# EAGLE board M.2 SoM breakout board v0.1 (EAGLE 9.6.2), part 1 of 2
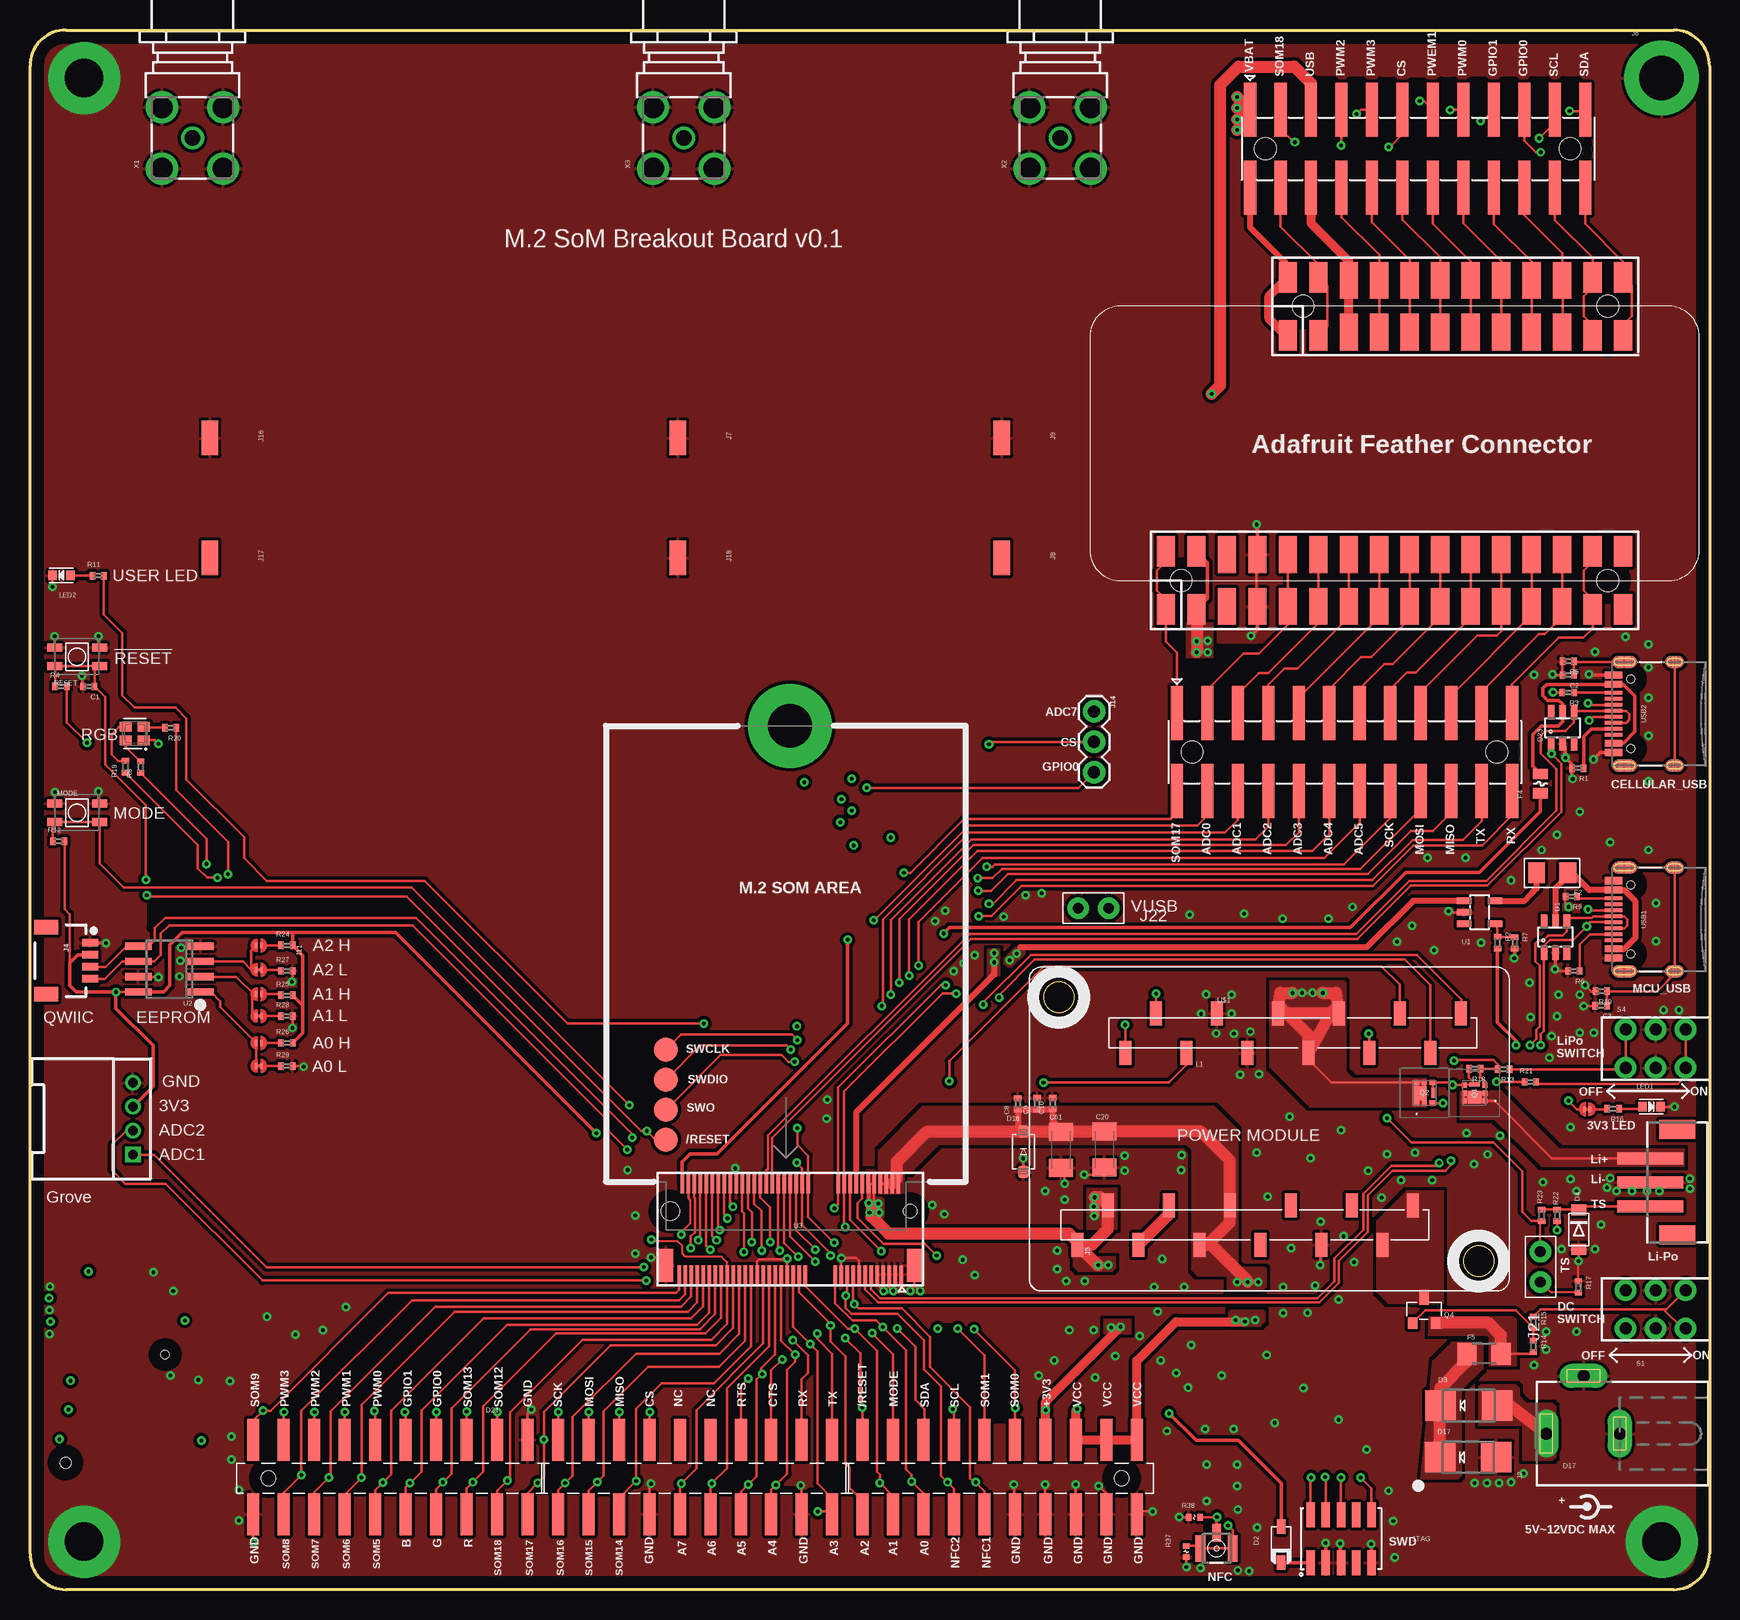
[diagram p3: board, top side]
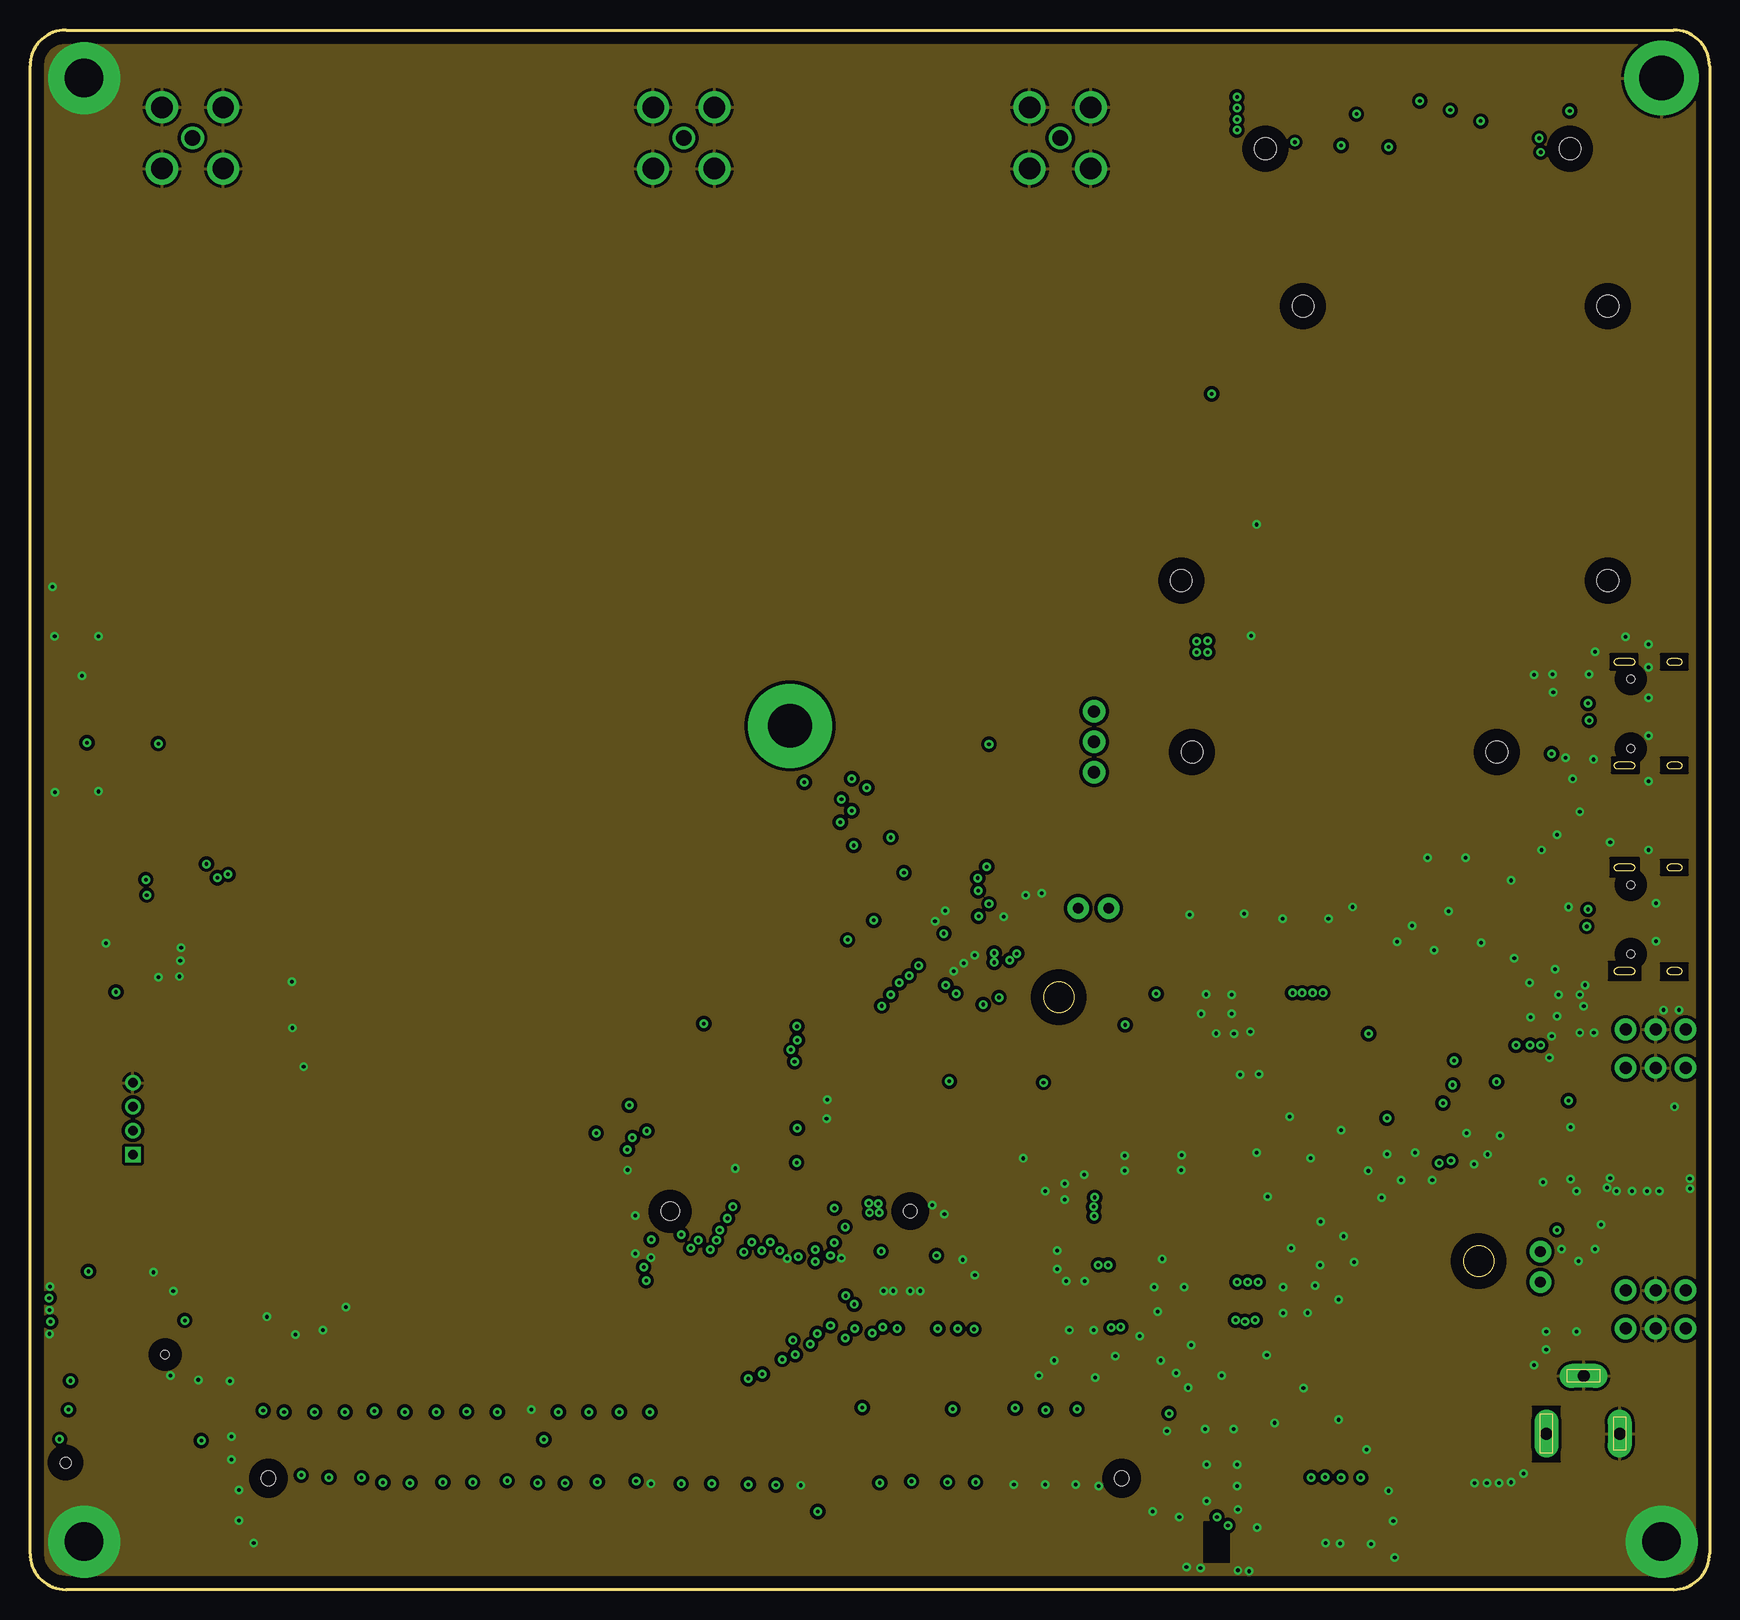
[diagram p4: board, inner layer GND]
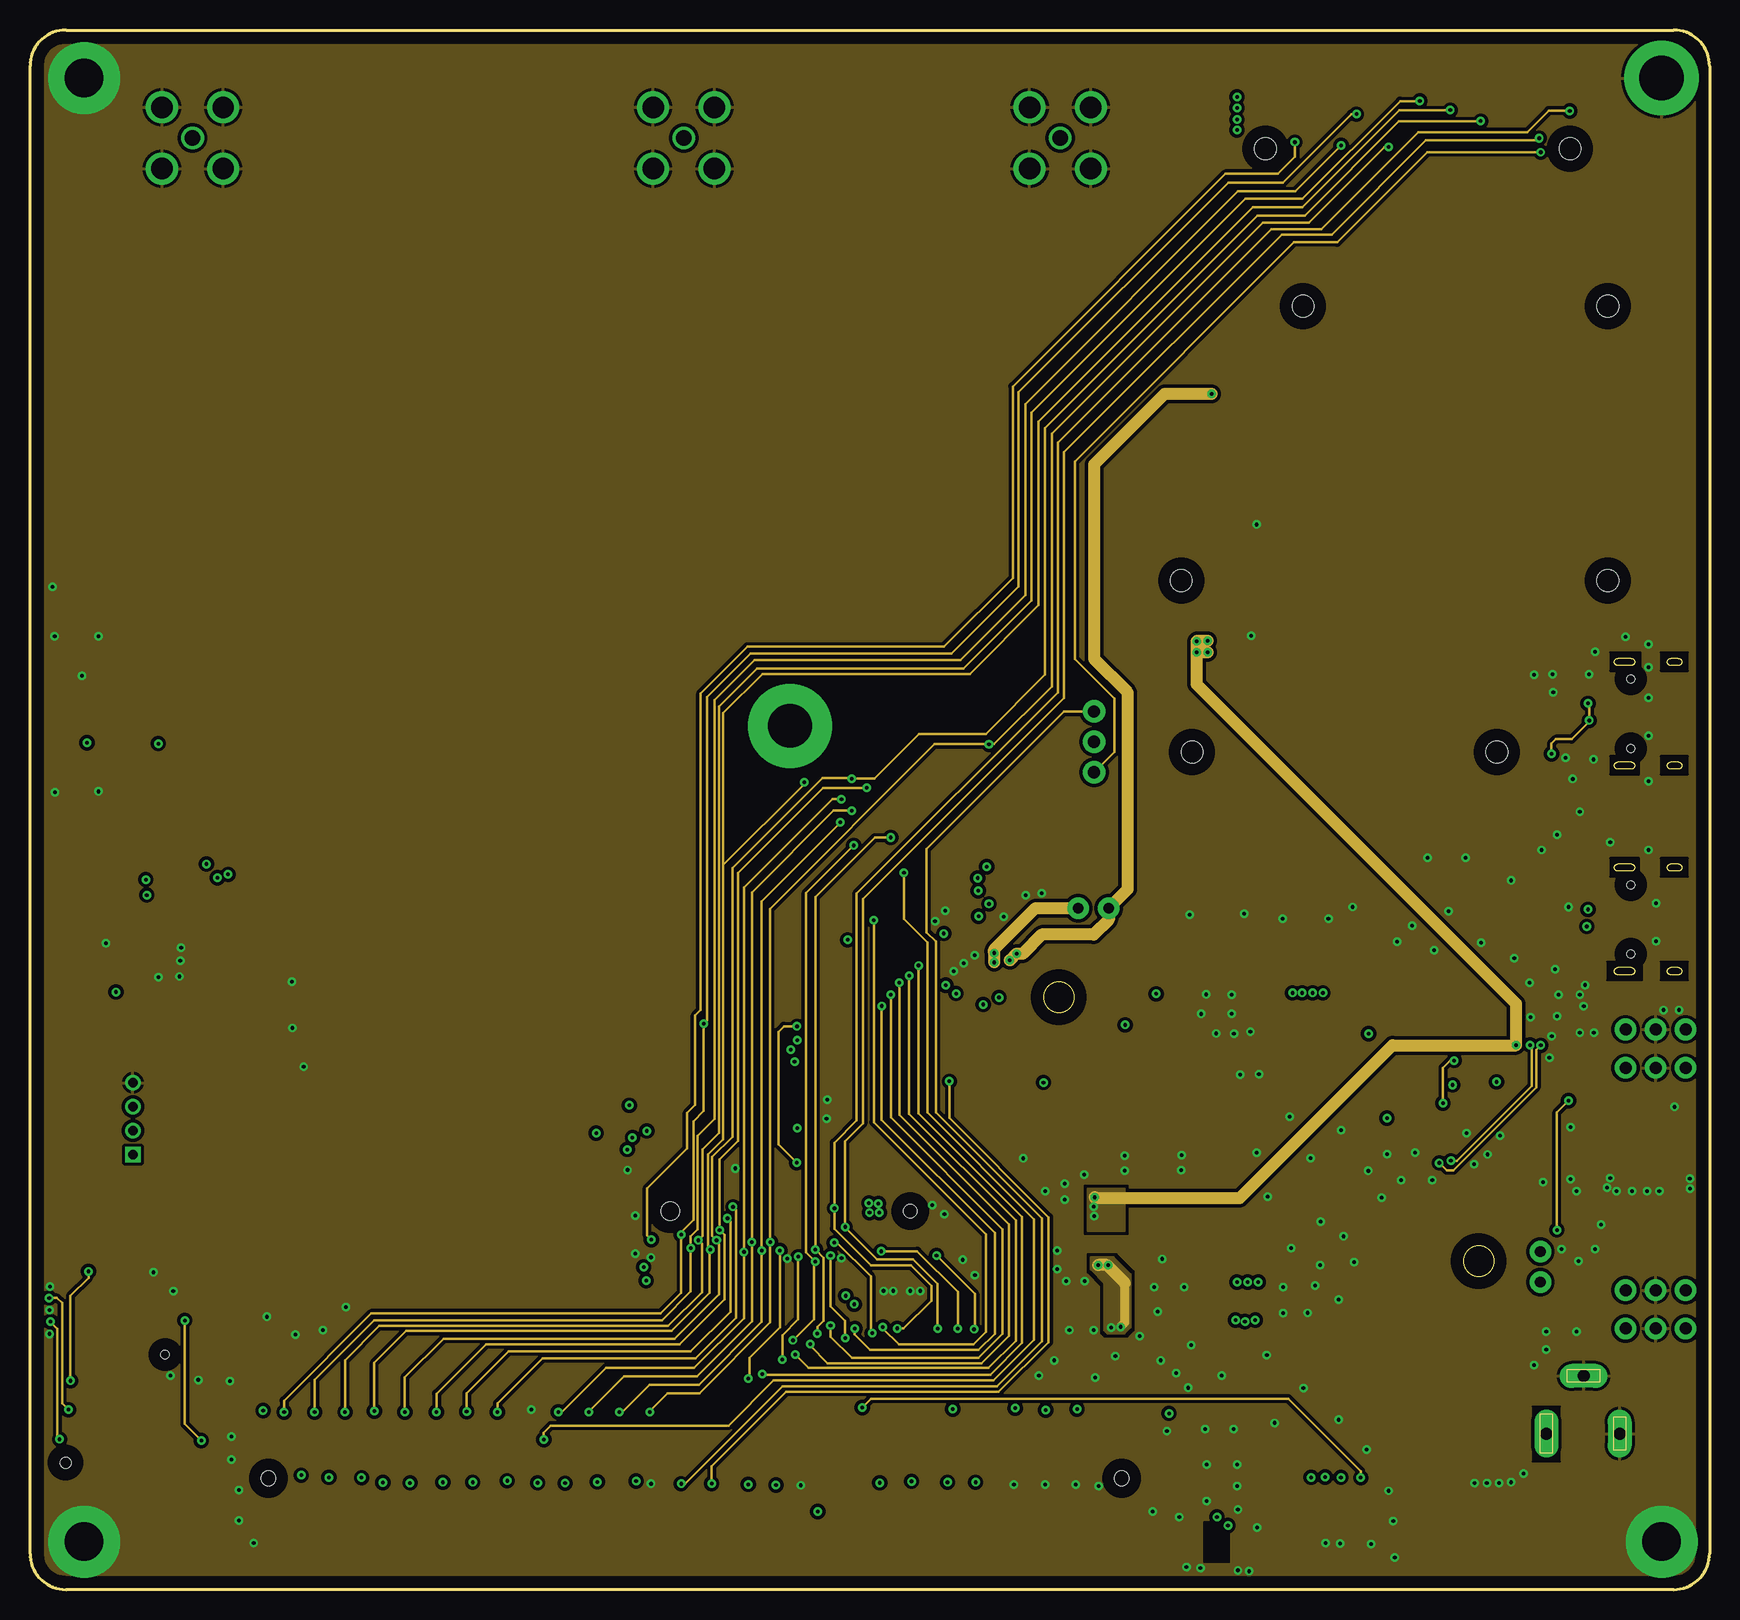
[diagram p5: board, inner layer POWER]
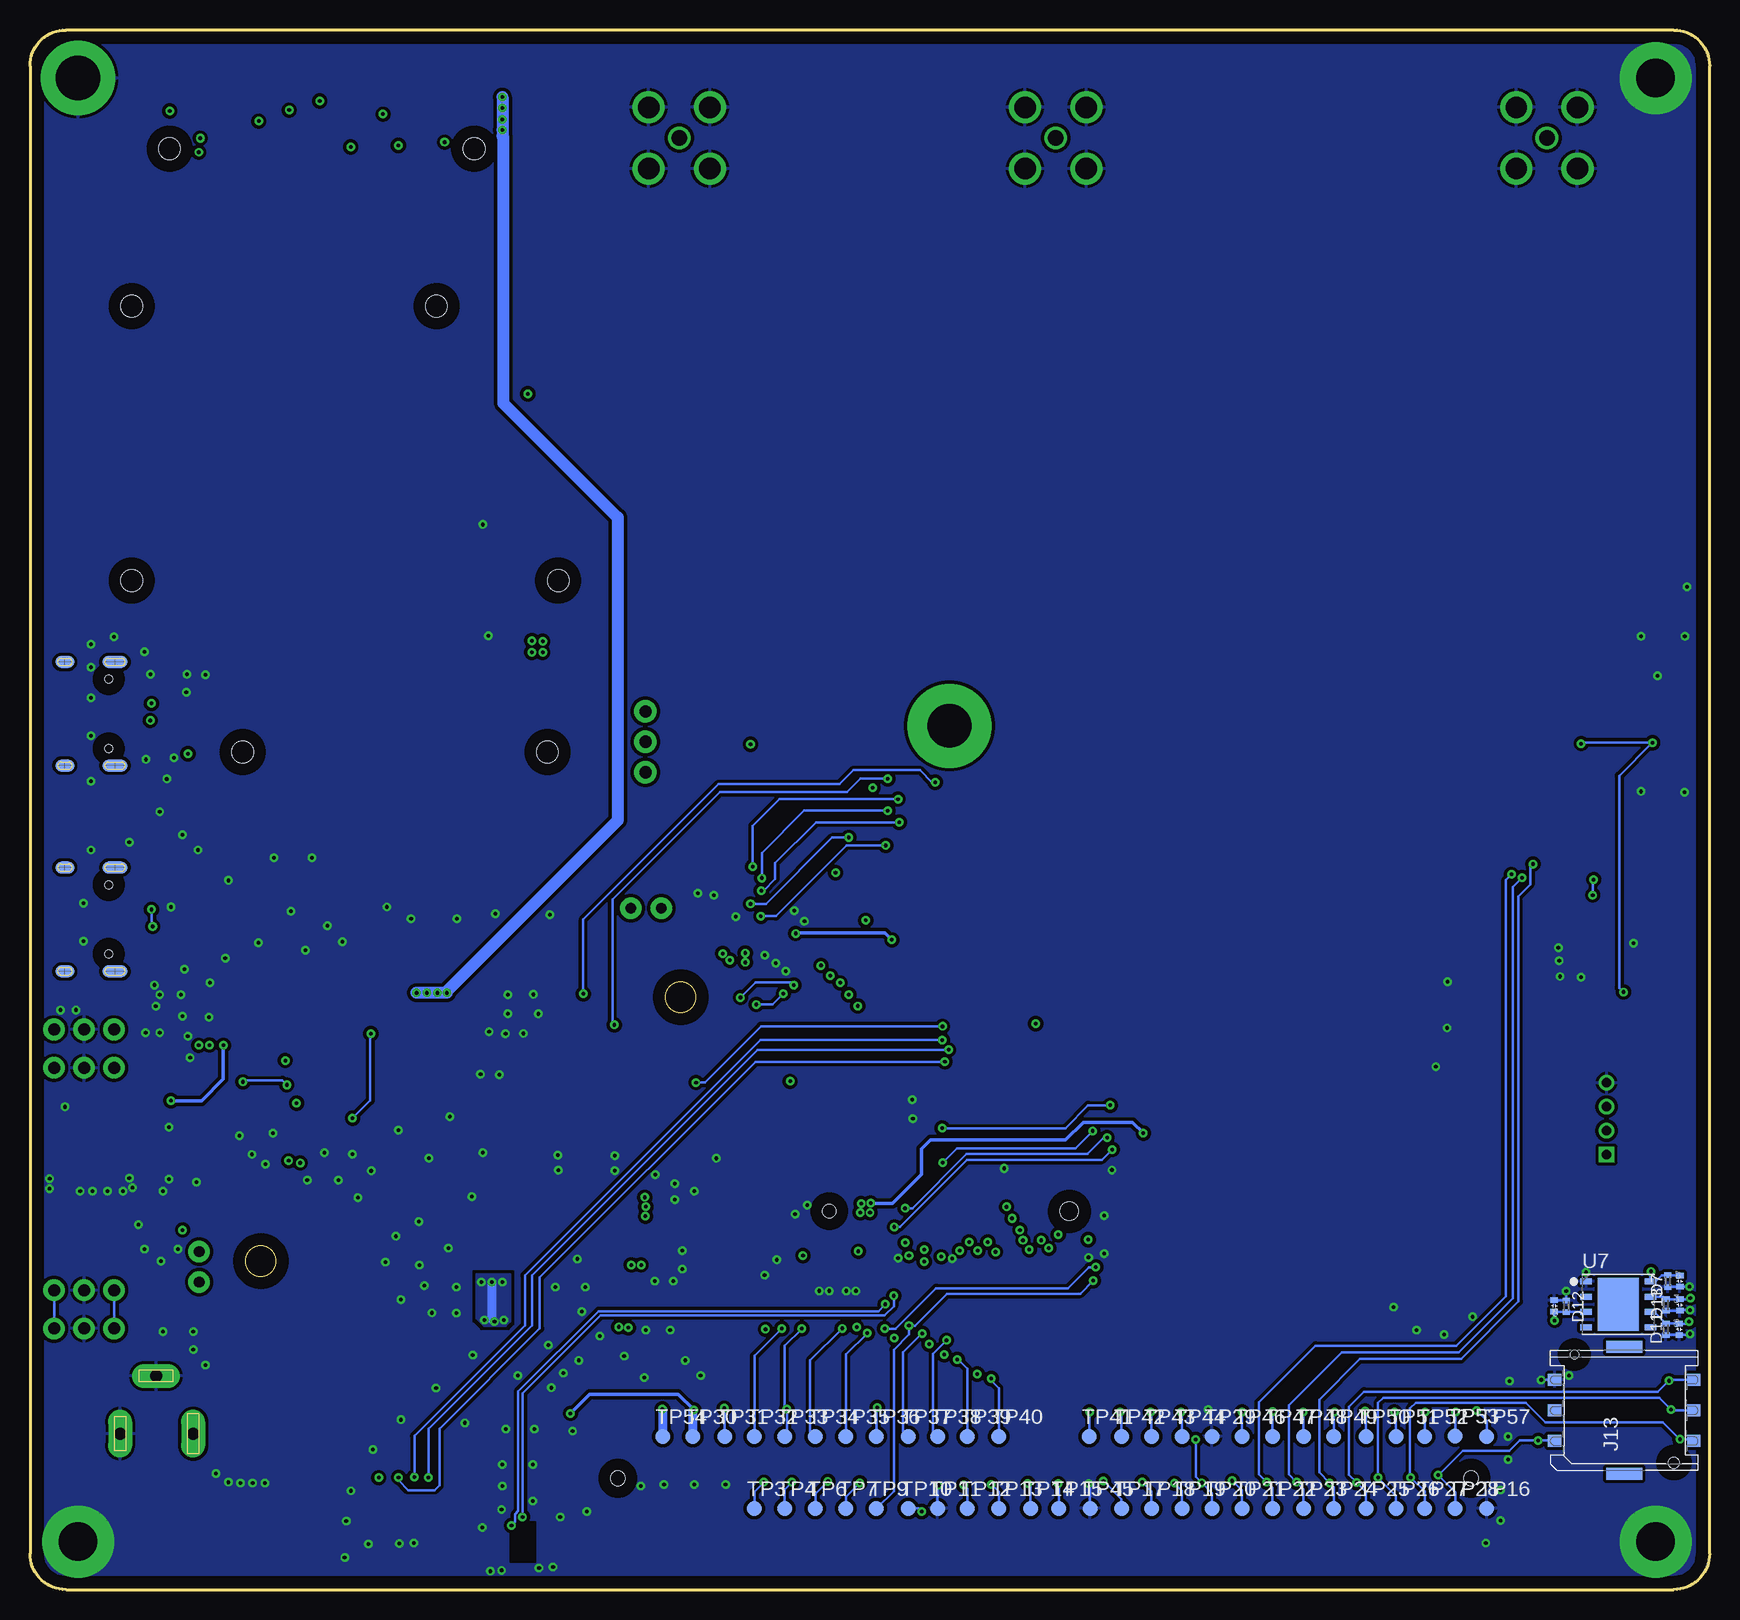
[diagram p6: board, bottom side, seen from below]

Size 140 x 130 mm. Coordinates in mm from the lower left corner, seen from the top.
Outline: 3,130 137,130 arc-90 140,127 140,3 arc-90 137,0 3,0 arc-90 0,3 0,127 arc-90 3,130
Copper layers (1+2*3+16): Top 0.035mm / dielectric 1.5mm / GND 0.035mm / dielectric 0.15mm / POWER 0.035mm / dielectric 0.2mm / Bottom 0.035mm
Design rules "default *": minimum track width 6mil, minimum drill 0.3mm, track to track 6mil, track to pad 6mil, pad to pad 6mil, via to via 6mil, smd to smd 6mil, copper to edge 40mil, drill to drill 6mil, minimum pad ring 10mil, minimum via ring 8mil, stop-mask expansion 4mil, vias tented up to drill 0.35mm, thermal gap 10mil
Net classes: 0 default: width 0.152 mm, clearance 0.152 mm; 1 power: width 0.254 mm, drill 0.61 mm, clearance 0.203 mm; 2 120R_Impedance: width 0.152 mm; 3 BAT: clearance 0.203 mm
tKeepout: 1 lines
tRestrict: 57 lines

## Footprints (pad centres in the part's own frame; a part is rotated, then mirrored left to right if it is on the bottom)
C0402_B = smd 0.457 x 0.61: 1 -0.483,0; 2 0.483,0
C1206K = smd 1.5 x 2: 1 -1.5,0; 2 1.5,0
SOT23-6 = smd 0.55 x 1.2: 1 -0.95,-1.3; 2 0,-1.3; 3 0.95,-1.3; 4 0.95,1.3; 5 0,1.3; 6 -0.95,1.3
SOD-123 = smd 1.2 x 0.7: 1 -1.5,0; 2 1.5,0
SMADIODE = smd 2.54 x 2.54: A 2.349,0; C -2.349,0
SOD-123FL = smd 0.91 x 1.22: A 1.637,0; C -1.637,0
C0402 = smd 0.45 x 0.6: 1 -0.47,0; 2 0.47,0
SOD-123' = smd 1.02 x 0.86: A 1.68,0; C -1.68,0
R1206 = smd 1.4 x 1.7: 1 -1.3,0; 2 1.3,0
F0805 = smd 0.85 x 1.25: P$1 -0.8,0; P$2 0.8,0
R1206' = smd 1.6 x 1.803: 1 -1.422,0; 2 1.422,0
JST-3-SMD-VERT = smd 1 x 5.5: 1 -2,0; 2 0,0; 3 2,0 | smd 1.6 x 3: PAD1 -4.4,-2.25; PAD2 4.4,-2.25
DCJ0202 = drill 1 pad 2 long: 1 0,3.1; 2 4.8,0; 3 0,-3
SPARK_CON_30X2_SMD = smd 1 x 3.5: 1 0,3.013; 2 0,-3.213; 3 2.54,3.013; 4 2.54,-3.213; 5 5.08,3.013; 6 5.08,-3.213; 7 7.62,3.013; 8 7.62,-3.213; 9 10.16,3.013; 10 10.16,-3.213; 11 12.7,3.013; 12 12.7,-3.213; 13 15.24,3.013; 14 15.24,-3.213; 15 17.78,3.013; 16 17.78,-3.213; 17 20.32,3.013; 18 20.32,-3.213; 19 22.86,3.013; 20 22.86,-3.213; 21 25.4,3.013; 22 25.4,-3.213; 23 27.94,3.013; 24 27.94,-3.213; 25 30.48,3.013; 26 30.48,-3.213; 27 33.02,3.013; 28 33.02,-3.213; 29 35.56,3.013; 30 35.56,-3.213; 31 38.1,3.013; 32 38.1,-3.213; 33 40.64,3.013; 34 40.64,-3.213; 35 43.18,3.013; 36 43.18,-3.213; 37 45.72,3.013; 38 45.72,-3.213; 39 48.26,3.013; 40 48.26,-3.213; 41 50.8,3.013; 42 50.8,-3.213; 43 53.34,3.013; 44 53.34,-3.213; 45 55.88,3.013; 46 55.88,-3.213; 47 58.42,3.013; 48 58.42,-3.213; 49 60.96,3.013; 50 60.96,-3.213; 51 63.5,3.013; 52 63.5,-3.213; 53 66.04,3.013; 54 66.04,-3.213; 55 68.58,3.013; 56 68.58,-3.213; 57 71.12,3.013; 58 71.12,-3.213; 59 73.66,3.013; 60 73.66,-3.213 | hole 1.2: 1.27,0; 72.39,0
1X04_1MM_RA = smd 0.6 x 1.35: 1 -1.5,0; 2 -0.5,0; 3 0.5,0; 4 1.5,0 | smd 1.2 x 2: NC1 2.8,-3.675; NC2 -2.8,-3.675
PARTICLE-POWER-MODULE = smd 1 x 2: 1 31.99,7.15; 2 29.45,3.85; 3 26.91,7.15; 4 24.37,3.85; 5 21.83,7.15; 6 19.29,3.85; 7 16.75,7.15; 8 14.21,3.85; 9 11.67,7.15; 10 9.13,3.85; 11 6.59,7.15; 12 4.05,3.85; 13 35.99,23.15; 14 33.45,19.85; 15 30.91,23.15; 16 28.37,19.85; 17 25.83,23.15; 18 23.29,19.85; 19 20.75,23.15; 20 18.21,19.85; 21 15.67,23.15; 22 13.13,19.85; 23 10.59,23.15; 24 8.05,19.85
SCREW-HOLE-3.7 = drill 3.7 pad 6.2: P$1 0,0
ANTENNA-CLAMP1.13 = smd 2.9 x 1.4: 1 0,0
CON_12*2_SMD_HEADER = smd 1.02 x 4.5: 1 0,0.65; 2 0,-5.85; 3 2.54,0.65; 4 2.54,-5.85; 5 5.08,0.65; 6 5.08,-5.85; 7 7.62,0.65; 8 7.62,-5.85; 9 10.16,0.65; 10 10.16,-5.85; 11 12.7,0.65; 12 12.7,-5.85; 13 15.24,0.65; 14 15.24,-5.85; 15 17.78,0.65; 16 17.78,-5.85; 17 20.32,0.65; 18 20.32,-5.85; 19 22.86,0.65; 20 22.86,-5.85; 21 25.4,0.65; 22 25.4,-5.85; 23 27.94,0.65; 24 27.94,-5.85 | hole 1.8: 1.27,-2.6; 26.67,-2.6
HW4-2.0-90D = drill 0.8 pad 1.27 square: 1 -3,0 | drill 0.8 pad 1.27: 2 -1,0; 3 1,0; 4 3,0
TP_OPEN = smd 0.2 x 0.5: 1 -0.21,0; 2 0.21,0
GCT-SIM8100 = smd 1 x 1.1: C1 2.54,-5.8; C2 0,-5.8; C3 -2.54,-5.8; C5 2.54,5.8; C6 0,5.8; C7 -2.54,5.8 | smd 1 x 3: NC@1 -5.3,0; NC@2 5.3,0 | hole 0.7: 4.65,4.15 | hole 0.9: -4.35,-4.15
1X03 = drill 1.016 pad 1.88: 1 0,0; 2 2.54,0; 3 5.08,0
SIP-2 = drill 0.9 pad 1.8: 1 -1.27,0; 2 1.27,0
CONN5X2_1.27 = smd 0.7 x 2.1: 1 -2.54,-2; 2 -2.54,2; 3 -1.27,-2; 4 -1.27,2; 5 0,-2; 6 0,2; 7 1.27,-2; 8 1.27,2; 9 2.54,-2; 10 2.54,2
LED0603 = smd 0.7 x 0.8: 1 -0.75,0; 2 0.75,0
TACTILE_SWITCH_SMD = smd 1.25 x 0.65: 1 -1.875,0.775; 2 1.875,0.775; 3 -1.875,-0.775; 4 1.875,-0.775
FEATHERWING_SMT2 = smd 1.524 x 2.54: 1 6.35,2.413; 1' 6.35,-2.413; 2 8.89,2.413; 2' 8.89,-2.413; 15 41.91,2.413; 15' 41.91,-2.413; 16 44.45,2.413; 16' 44.45,-2.413; 17 44.45,20.447; 17' 44.45,25.273; 18 41.91,20.447; 18' 41.91,25.273; 27 19.05,20.447; 27' 19.05,25.273; 28 16.51,20.447; 28' 16.51,25.273 | smd 1.524 x 3.048: 3 11.43,2.159; 3' 11.43,-2.159; 4 13.97,2.159; 4' 13.97,-2.159; 5 16.51,2.159; 5' 16.51,-2.159; 6 19.05,2.159; 6' 19.05,-2.159; 7 21.59,2.159; 7' 21.59,-2.159; 8 24.13,2.159; 8' 24.13,-2.159; 9 26.67,2.159; 9' 26.67,-2.159; 10 29.21,2.159; 10' 29.21,-2.159; 11 31.75,2.159; 11' 31.75,-2.159; 12 34.29,2.159; 12' 34.29,-2.159; 13 36.83,2.159; 13' 36.83,-2.159; 14 39.37,2.159; 14' 39.37,-2.159; 19 39.37,20.701; 19' 39.37,25.019; 20 36.83,20.701; 20' 36.83,25.019; 21 34.29,20.701; 21' 34.29,25.019; 22 31.75,20.701; 22' 31.75,25.019; 23 29.21,20.701; 23' 29.21,25.019; 24 26.67,20.701; 24' 26.67,25.019; 25 24.13,20.701; 25' 24.13,25.019; 26 21.59,20.701; 26' 21.59,25.019 | hole 1.8: 17.78,22.86; 43.18,22.86; 7.62,0; 43.18,0
IPEX-20279-001E = smd 0.73 x 1.5: 1 0,1.28 | smd 0.8 x 2.2: 2@1 -1.35,0; 2@2 1.35,0
RF4C100BCTCR = smd 0.45 x 0.425: 1 -0.65,-0.862; 2 0,-0.862; 3 0.65,-0.862; 4 0.65,0.863; 5 0,0.863; 6 -0.65,0.863 | smd 1.05 x 1.15: 7 -0.35,0 | smd 0.3 x 0.85: 8 0.725,0
SOT-23 = smd 0.8 x 0.95: 1 -0.95,-1; 2 0.95,-1 | smd 0.8 x 1.25: 3 0,1.15
R0402_B = smd 0.457 x 0.61: 1 -0.483,0; 2 0.483,0
R-0402S = smd 0.45 x 0.55: 1 -0.47,0; 2 0.47,0
PLCC4-2MM-RGB = smd 1 x 0.8: BLUE -0.75,-0.55; CA 0.75,-0.55; GREEN -0.75,0.55; RED 0.75,0.55
SWITCH-2.5X3.2-6 = drill 1 pad 1.8: 1 0,0; 2 0,2.5; 3 0,5; 4 3.2,0; 5 3.2,2.5; 6 3.2,5
TP_SHORT = smd 0.2 x 0.5: 1 -0.21,0; 2 0.21,0
B1,27 = smd 1.27 x 1.27: TP 0,0
SOT25 = smd 0.55 x 1.2: 1 -0.95,-1.3; 2 0,-1.3; 3 0.95,-1.3; 4 0.95,1.3; 5 -0.95,1.3
SO-08 = smd 0.6 x 2.2: 1 -1.905,-2.6; 2 -0.635,-2.6; 3 0.635,-2.6; 4 1.905,-2.6; 5 1.905,2.6; 6 0.635,2.6; 7 -0.635,2.6; 8 -1.905,2.6
PARTICLE_M.2EKEY_3.65MM_DRILL = smd 0.3 x 1.55: 1 -9.62,3.735; 2 -9.37,-3.815; 3 -9.12,3.735; 4 -8.87,-3.815; 5 -8.62,3.735; 6 -8.37,-3.815; 7 -8.12,3.735; 8 -7.87,-3.815; 9 -7.62,3.735; 10 -7.37,-3.815; 11 -7.12,3.735; 12 -6.87,-3.815; 13 -6.62,3.735; 14 -6.37,-3.815; 15 -6.12,3.735; 16 -5.87,-3.815; 17 -5.62,3.735; 18 -5.37,-3.815; 19 -5.12,3.735; 20 -4.87,-3.815; 21 -4.62,3.735; 22 -4.37,-3.815; 23 -4.12,3.735; 32 -1.87,-3.815; 33 -1.62,3.735; 34 -1.37,-3.815; 35 -1.12,3.735; 36 -0.87,-3.815; 37 -0.62,3.735; 38 -0.37,-3.815; 39 -0.12,3.735; 40 0.13,-3.815; 41 0.38,3.735; 42 0.63,-3.815; 43 0.88,3.735; 44 1.13,-3.815; 45 1.38,3.735; 46 1.63,-3.815; 47 1.88,3.735; 48 2.13,-3.815; 49 2.38,3.735; 50 2.63,-3.815; 51 2.88,3.735; 52 3.13,-3.815; 53 3.38,3.735; 54 3.63,-3.815; 55 3.88,3.735; 56 4.13,-3.815; 57 4.38,3.735; 58 4.63,-3.815; 59 4.88,3.735; 60 5.13,-3.815; 61 5.38,3.735; 62 5.63,-3.815; 63 5.88,3.735; 64 6.13,-3.815; 65 6.38,3.735; 66 6.63,-3.815; 67 6.88,3.735; 68 7.13,-3.815; 69 7.38,3.735; 70 7.63,-3.815; 71 7.88,3.735; 72 8.13,-3.815; 73 8.38,3.735; 74 8.63,-3.815; 75 8.88,3.735 | smd 1.2 x 2.75: 76 9.98,2.96; 77 -10.72,2.96 | smd 2 x 2: !RESET 10,-7.5; SWCLK 10,-15; SWDIO 10,-12.5; SWO 10,-10 | drill 3.65 pad 7: GND -0.351,-42 | hole 1.1: -10.37,-1.54 | hole 1.55: 9.63,-1.54
MFF2 = smd 0.96 x 0.5: 1 -2.675,1.905; 2 -2.675,0.635; 3 -2.675,-0.635; 4 -2.675,-1.905; 5 2.675,-1.905; 6 2.675,-0.635; 7 2.675,0.635; 8 2.675,1.905 | smd 3.4 x 4.4: P$1 0,0
USB-C-16P = smd 0.3 x 1.45: A5 -1.25,0; A6 -0.25,0; A7 0.25,0; A8 1.25,0; B5 1.75,0; B6 0.75,0; B7 -0.75,0; B8 -1.75,0 | smd 0.6 x 1.45: GND -3.225,0; GND2 3.225,0 | smd 1 x 2.1: SHLD1 -4.32,-0.915; SHLD2 4.32,-0.915 | smd 1 x 2.1 bottom: SHLD3 -4.32,-0.915; SHLD4 4.32,-0.915 | smd 1 x 1.6: SHLD5 -4.32,-5.095; SHLD8 4.32,-5.095 | smd 1 x 1.6 bottom: SHLD6 -4.32,-5.095; SHLD7 4.32,-5.095 | smd 0.55 x 1.45: VBUS1 -2.45,0; VBUS2 2.45,0 | hole 0.65: -2.89,-1.445; 2.89,-1.445
BU-SMA-G = drill 1.27: 1 0,0 | drill 1.778: 2 -2.55,2.55; 3 2.55,2.55; 4 2.55,-2.55; 5 -2.55,-2.55

## Placement (x,y rotation side)
C1  0.1uF  [C0402_B]  4.9,75.27 180 top
C2  0.1uF  [C0402_B]  128.22,76.22 180 top
C3  0.1uF  [C0402_B]  130.96,48.67 180 top
C4  33pF  [C0402_B]  3.63,23.72 270 bottom
C5  33pF  [C0402_B]  11.94,23.62 90 bottom
C6  33pF  [C0402_B]  3.63,21.7 270 bottom
C7  0.1uF  [C0402_B]  3.48,25.71 270 bottom
C8  1nF  [C0402_B]  82.34,40.49 90 top
C9  100pF  [C0402_B]  83.95,40.5 90 top
C10  33pF  [C0402_B]  85.25,40.51 90 top
C20  100uF  [C1206K]  89.56,36.67 270 top
C61  100uF  [C1206K]  85.93,36.64 270 top
D1  TPESD0504S6  [SOT23-6]  127.16,54.39 0 top
D2  B5819w  [SOD-123]  104.29,3.73 270 top
D3  SX34_R1_00001  [SMADIODE]  119.94,15.34 0 top
D4  SMF3.3  [SOD-123FL]  129.1,30 270 top
D7  0402ESDA-05N  [C0402]  2.46,25.7 90 bottom
D11  0402ESDA-05N  [C0402]  2.51,21.69 90 bottom
D12  0402ESDA-05N  [C0402]  12.95,23.65 270 bottom
D13  0402ESDA-05N  [C0402]  2.46,23.72 90 bottom
D16  BZT52C3V9  [SOD-123']  82.82,36.5 270 top
D17  SMAJ15CA-13-F  [SMADIODE]  119.87,11.03 0 top
D23  DNP MAX3207EAUT+T  [SOT23-6]  127.75,71.82 0 top
F2  RF1512-000  [R1206]  126.88,59.74 180 top
F4  NC  [F0805]  125.9,67.18 90 top
F5  16V/0.75A  [R1206']  121.2,19.65 0 top
J1  [JST-3-SMD-VERT]  135.06,33.95 90 top
J2  DCJ0202  [DCJ0202]  129.5,13 90 top
J3  SPARK_CON_30X2_SMD  [SPARK_CON_30X2_SMD]  92.27,9.27 180 top
J4  [1X04_1MM_RA]  5.01,52.41 270 top
J5  PARTICLE-POWER-MODULE  [PARTICLE-POWER-MODULE]  83.26,24.88 0 top
J6  SCREW-HOLE-3.7  [SCREW-HOLE-3.7]  136,126 0 top
J7  ANTENNA-CLAMP  [ANTENNA-CLAMP1.13]  54,96 90 top
J8  ANTENNA-CLAMP  [ANTENNA-CLAMP1.13]  81,86 90 top
J9  ANTENNA-CLAMP  [ANTENNA-CLAMP1.13]  81,96 90 top
J10  CON_122_SMD_HEADER  [CON_12*2_SMD_HEADER]  101.7,122.7 0 top
J11  4P-2.0-90D  [HW4-2.0-90D]  8.58,39.25 90 top
J12  TP_OPEN  [TP_OPEN]  19.08,53.7 180 top
J13  SIM-NANO-4FF  [GCT-SIM8100]  7.11,14.93 90 bottom
J14  [1X03]  88.7,73.2 270 top
J15  CON_122_SMD_HEADER  [CON_12*2_SMD_HEADER]  95.6,72.4 0 top
J16  ANTENNA-CLAMP  [ANTENNA-CLAMP1.13]  15,96 90 top
J17  ANTENNA-CLAMP  [ANTENNA-CLAMP1.13]  15,86 90 top
J18  ANTENNA-CLAMP  [ANTENNA-CLAMP1.13]  54,86 90 top
J19  TP_OPEN  [TP_OPEN]  19.08,49.63 180 top
J20  TP_OPEN  [TP_OPEN]  19.08,45.57 180 top
J21  SIP-2  [SIP-2]  125.9,26.9 270 top
J22  SIP-2  [SIP-2]  88.65,56.79 0 top
JTAG  CONN5X2  [CONN5X2_1.27]  109.28,4.23 0 top
LED1  RED  [LED0603]  135.15,40.24 0 top
LED2  BLUE  [LED0603]  2.62,84.53 180 top
MODE  [TACTILE_SWITCH_SMD]  3.92,64.75 0 top
MS1  PARTICLE_MESH_SMTDUAL  [FEATHERWING_SMT2]  88.34,84.11 0 top
NFC  UFL  [IPEX-20279-001E]  98.92,3.43 0 top
Q1  RF4C100BCTCR  [RF4C100BCTCR]  120.41,41.38 90 top
Q2  RF4C100BCTCR  [RF4C100BCTCR]  116.23,41.4 0 top
Q4  IRLML6401  [SOT-23]  116.2,23.22 0 top
R1  5.1k  [R0402_B]  129.02,68.47 180 top
R2  1M  [R0402_B]  122.32,53.91 270 top
R3  5.1k  [R0402_B]  128.21,74.77 180 top
R4  10K  [R0402_B]  2.58,75.28 0 top
R5  1M  [R0402_B]  128.23,77.37 180 top
R6  5.1k  [R0402_B]  128.69,51.57 180 top
R7  1K  [R0402_B]  123.76,53.89 270 top
R8  1K  [R0402_B]  9.22,68.55 90 top
R9  5.1k  [R0402_B]  128.48,57.78 180 top
R10  1M  [R0402_B]  130.97,49.87 180 top
R11  1K  [R0402_B]  5.67,84.51 0 top
R12  DNP  [R0402_B]  2.39,62.38 0 top
R13  1K  [R0402_B]  122.83,43.37 180 top
R14  100K  [R0402_B]  125.31,20.29 270 top
R15  1K  [R0402_B]  125.31,22.28 270 top
R16  1K  [R0402_B]  131.96,40.08 180 top
R17  10K  [R0402_B]  129.06,25.24 270 top
R18  10M  [R0402_B]  120.43,43.42 180 top
R19  1K  [R0402_B]  7.96,68.58 90 top
R20  1K  [R0402_B]  11.72,71.84 180 top
R21  100K  [R0402_B]  125.07,42.31 0 top
R22  1K  [R0402_B]  127.3,31.2 270 top
R23  0R  [R0402_B]  126,31.2 90 top
R24  10K  [R0402_B]  21.42,53.7 0 top
R25  10K  [R0402_B]  21.42,49.53 0 top
R26  10K  [R0402_B]  21.42,45.57 0 top
R27  100K  [R0402_B]  21.42,51.56 0 top
R28  100K  [R0402_B]  21.42,47.8 0 top
R29  100K  [R0402_B]  21.42,43.64 0 top
R37  ESD NC  [R-0402S]  96.38,3.16 270 top
R38  ESD NC  [R-0402S]  97.06,6.02 0 top
RESET  [TACTILE_SWITCH_SMD]  3.92,77.75 0 top
RGB  RGB-LED-CLMVB-FKARGB  [PLCC4-2MM-RGB]  8.74,71.35 0 top
S1  [SWITCH-2.5X3.2-6]  133,24.95 270 top
S4  [SWITCH-2.5X3.2-6]  133,46.69 270 top
T1  TP_SHORT  [TP_SHORT]  129.8,40.04 0 top
TP3  TPSB1,27  [B1,27]  79.62,6.76 0 bottom
TP4  TPSB1,27  [B1,27]  77.1,6.76 0 bottom
TP6  TPSB1,27  [B1,27]  74.53,6.76 0 bottom
TP7  TPSB1,27  [B1,27]  71.98,6.76 0 bottom
TP9  TPSB1,27  [B1,27]  69.44,6.76 0 bottom
TP10  TPSB1,27  [B1,27]  66.81,6.76 0 bottom
TP11  TPSB1,27  [B1,27]  64.34,6.76 0 bottom
TP12  TPSB1,27  [B1,27]  61.86,6.76 0 bottom
TP13  TPSB1,27  [B1,27]  59.24,6.76 0 bottom
TP14  TPSB1,27  [B1,27]  56.6,6.76 0 bottom
TP15  TPSB1,27  [B1,27]  54.23,6.76 0 bottom
TP16  TPSB1,27  [B1,27]  18.58,6.76 0 bottom
TP17  TPSB1,27  [B1,27]  49.02,6.76 0 bottom
TP18  TPSB1,27  [B1,27]  46.52,6.76 0 bottom
TP19  TPSB1,27  [B1,27]  43.97,6.76 0 bottom
TP20  TPSB1,27  [B1,27]  41.46,6.76 0 bottom
TP21  TPSB1,27  [B1,27]  38.97,6.76 0 bottom
TP22  TPSB1,27  [B1,27]  36.43,6.76 0 bottom
TP23  TPSB1,27  [B1,27]  33.85,6.76 0 bottom
TP24  TPSB1,27  [B1,27]  31.32,6.76 0 bottom
TP25  TPSB1,27  [B1,27]  28.63,6.76 0 bottom
TP26  TPSB1,27  [B1,27]  26.14,6.76 0 bottom
TP27  TPSB1,27  [B1,27]  23.75,6.76 0 bottom
TP28  TPSB1,27  [B1,27]  21.19,6.76 0 bottom
TP29  TPSB1,27  [B1,27]  41.46,12.77 0 bottom
TP30  TPSB1,27  [B1,27]  84.74,12.77 0 bottom
TP31  TPSB1,27  [B1,27]  82.09,12.77 0 bottom
TP32  TPSB1,27  [B1,27]  79.62,12.77 0 bottom
TP33  TPSB1,27  [B1,27]  77.1,12.77 0 bottom
TP34  TPSB1,27  [B1,27]  74.53,12.77 0 bottom
TP35  TPSB1,27  [B1,27]  71.98,12.77 0 bottom
TP36  TPSB1,27  [B1,27]  69.44,12.77 0 bottom
TP37  TPSB1,27  [B1,27]  66.81,12.77 0 bottom
TP38  TPSB1,27  [B1,27]  64.34,12.77 0 bottom
TP39  TPSB1,27  [B1,27]  61.86,12.77 0 bottom
TP40  TPSB1,27  [B1,27]  59.24,12.77 0 bottom
TP41  TPSB1,27  [B1,27]  51.69,12.77 0 bottom
TP42  TPSB1,27  [B1,27]  49.02,12.77 0 bottom
TP43  TPSB1,27  [B1,27]  46.52,12.77 0 bottom
TP44  TPSB1,27  [B1,27]  43.97,12.77 0 bottom
TP45  TPSB1,27  [B1,27]  51.64,6.76 0 bottom
TP46  TPSB1,27  [B1,27]  38.97,12.77 0 bottom
TP47  TPSB1,27  [B1,27]  36.43,12.77 0 bottom
TP48  TPSB1,27  [B1,27]  33.85,12.77 0 bottom
TP49  TPSB1,27  [B1,27]  31.32,12.77 0 bottom
TP50  TPSB1,27  [B1,27]  28.63,12.77 0 bottom
TP51  TPSB1,27  [B1,27]  26.14,12.77 0 bottom
TP52  TPSB1,27  [B1,27]  23.75,12.77 0 bottom
TP53  TPSB1,27  [B1,27]  21.19,12.81 0 bottom
TP54  TPSB1,27  [B1,27]  87.24,12.77 0 bottom
TP57  TPSB1,27  [B1,27]  18.58,12.77 0 bottom
U1  XC8107  [SOT25]  120.83,56.46 270 top
U2  AT24CS64-SSHM-B  [SO-08]  11.63,51.71 90 top
U3  M_SERIES_M.2KEY  [PARTICLE_M.2EKEY_3.65MM_DRILL]  63,30 180 top
U7  NC  [MFF2]  7.61,23.77 0 bottom
U$2  TP_SHORT  [TP_SHORT]  19.08,51.66 180 top
U$3  TP_SHORT  [TP_SHORT]  19.08,47.8 180 top
U$6  PARTICLE-LOGO  [PARTICLE-LOGO]  45.3,108.54 0 top
U$7  TP_SHORT  [TP_SHORT]  19.08,43.64 180 top
USB1  [USB-C-16P]  132,55.86 90 top
USB2  [USB-C-16P]  132,73 90 top
X1  BU-SMA-G  [BU-SMA-G]  13.55,121 90 top
X2  BU-SMA-G  [BU-SMA-G]  85.88,121 90 top
X3  BU-SMA-G  [BU-SMA-G]  54.5,121 90 top